# Altium project PCB_pibs_2u_otsd.PrjPcb
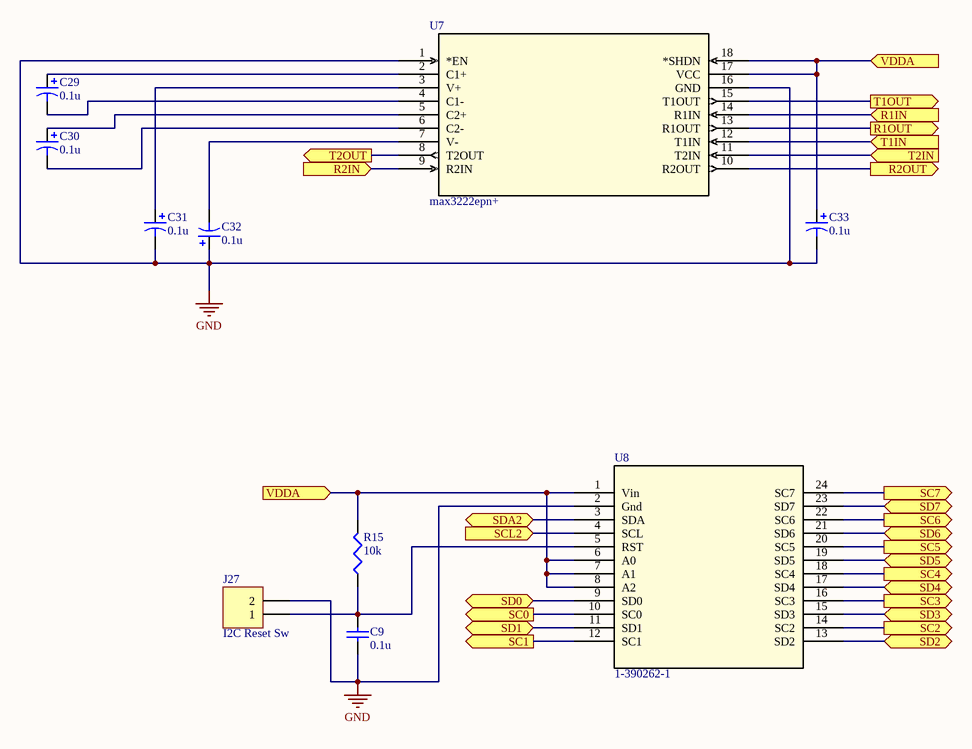
[diagram p0: digital.SchDoc]
12 sheets, 109 parts. Net scope: hierarchical (ports join the sheet entries above them; power ports are global).
Board file: pibs_2u_diff_usb_eth.PcbDoc
Sheets:
  digital.SchDoc
  i2c_diff.SchDoc
  i2c_diff_passive.SchDoc
  i2c_rj45_8_pak.SchDoc
  ftdi_usb.SchDoc
  mcf51jm128vlh.SchDoc
  top_pcb.SchDoc
    um232r = um232r.SchDoc
    ethernet = wiz810smj.SchDoc
    i2c_mux = TCA9548A.SchDoc
    power = power_simp.SchDoc
    headers = headers.SchDoc

## Sheet digital.SchDoc
size A

### Parts
C9  0.1u  [C1206]
C29  0.1u  [C0805]
C30  0.1u  [C0805]
C31  0.1u  [C0805]
C32  0.1u  [C0805]
C33  0.1u  [C0805]
J27  I2C Reset Sw  [HDR1X2]
R15  10k  [J1-0603]
U7  max3222epn+  [21-0043D_18_MXM]
U8  1-390262-1  [1-390262-1_TYC]

### Ports
R1IN (in), R1OUT (out), R2IN (in), R2OUT (out), SC0 (out), SC1 (out), SC2 (out), SC3 (out), SC4 (out), SC5 (out), SC6 (out), SC7 (out), SCL2 (in), SD0 (bidir), SD1 (bidir), SD2 (bidir), SD3 (bidir), SD4 (bidir), SD5 (bidir), SD6 (bidir), SD7 (bidir), SDA2 (bidir), T1IN (in), T1OUT (out), T2IN (in), T2OUT (out), VDDA (in)

### Nets
GND: C9.1 C31.2 C32.1 C33.2 J27.2 U7.1(*EN) U7.16(GND) U8.2(Gnd)
NetC9_2: C9.2 J27.1 R15.1 U8.5(RST)
NetC29_1: C29.1 U7.2(C1+)
NetC29_2: C29.2 U7.4(C1-)
NetC30_1: C30.1 U7.5(C2+)
NetC30_2: C30.2 U7.6(C2-)
NetC31_1: C31.1 U7.3(V+)
NetC32_2: C32.2 U7.7(V-)
NetC33_1: C33.1 R15.2 U7.17(VCC) U7.18(*SHDN) U8.1(Vin) U8.6(A0) U8.7(A1) U8.8(A2) ; port VDDA
NetU7_8: U7.8(T2OUT) ; port T2OUT
NetU7_9: U7.9(R2IN) ; port R2IN
NetU7_10: U7.10(R2OUT) ; port R2OUT
NetU7_11: U7.11(T2IN) ; port T2IN
NetU7_12: U7.12(T1IN) ; port T1IN
NetU7_13: U7.13(R1OUT) ; port R1OUT
NetU7_14: U7.14(R1IN) ; port R1IN
NetU7_15: U7.15(T1OUT) ; port T1OUT
NetU8_3: U8.3(SDA) ; port SDA2
NetU8_4: U8.4(SCL) ; port SCL2
NetU8_9: U8.9(SD0) ; port SD0
NetU8_10: U8.10(SC0) ; port SC0
NetU8_11: U8.11(SD1) ; port SD1
NetU8_12: U8.12(SC1) ; port SC1
NetU8_13: U8.13(SD2) ; port SD2
NetU8_14: U8.14(SC2) ; port SC2
NetU8_15: U8.15(SD3) ; port SD3
NetU8_16: U8.16(SC3) ; port SC3
NetU8_17: U8.17(SD4) ; port SD4
NetU8_18: U8.18(SC4) ; port SC4
NetU8_19: U8.19(SD5) ; port SD5
NetU8_20: U8.20(SC5) ; port SC5
NetU8_21: U8.21(SD6) ; port SD6
NetU8_22: U8.22(SC6) ; port SC6
NetU8_23: U8.23(SD7) ; port SD7
NetU8_24: U8.24(SC7) ; port SC7

### Library data of the parts
C9 = Cap Semi: Capacitor (Semiconductor SIM Model); Value: 100pF; Published: 8-Jun-2000; LatestRevisionDate: 29-May-2009; LatestRevisionNote: IPC-7351 Footprint Added.; PackageReference: C1206; Publisher: Altium Limited; PackageDescription: Chip Capacitor
C29-C33 = Cap Pol3: Polarized Capacitor (Surface Mount); Value: 100pF; Published: 8-Jun-2000; LatestRevisionDate: 29-May-2009; LatestRevisionNote: IPC-7351 Footprint Added.; PackageReference: C0805; Publisher: Altium Limited; PackageDescription: Chip Capacitor
J27 = Header 2: LatestRevisionDate: 17-Jul-2002; LatestRevisionNote: Re-released for DXP Platform.; Publisher: Altium Limited
R15 = Res3: Resistor; Value: 1K; Published: 8-Jun-2000; LatestRevisionDate: 29-May-2009; LatestRevisionNote: IPC-7351 Footprint Added.; PackageReference: J1-0603; Publisher: Altium Limited; PackageDescription: Chip Resistor
U7 = max3222epn+: No Description Available; Mfr_Name: Maxim Integrated Products; Copyright: Copyright (C) 2022 Ultra Librarian. All rights reserved.; Manufacturer_Part_Number: max3222epn+; Digi-Key_Part_Number_1: MAX3222EPN+-ND; RefDes: RefDes; Type: DEV
U8 = 1-390262-1: No Description Available; Mfr_Name: TE Connectivity; Copyright: Copyright (C) 2022 Ultra Librarian. All rights reserved.; Manufacturer_Part_Number: 1-390262-1; RefDes: RefDes; Type: DEV

## Sheet i2c_diff.SchDoc
size A
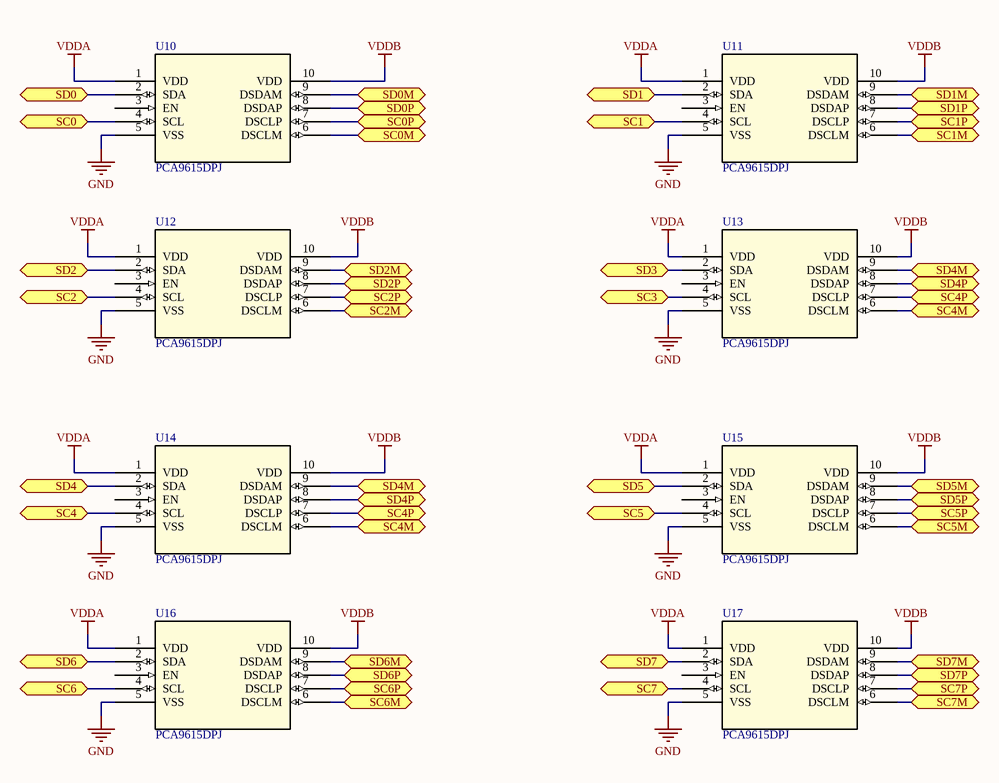
[diagram p1: i2c_diff.SchDoc]

### Parts
(Parts that share a designator on the sheet are numbered #1, #2 ... from top to bottom, then left to right.)
U10  PCA9615DPJ  [TSSOP10_3P1X3P1_NXP]
U11#1  PCA9615DPJ  [TSSOP10_3P1X3P1_NXP]
U12  PCA9615DPJ  [TSSOP10_3P1X3P1_NXP]
U13  PCA9615DPJ  [TSSOP10_3P1X3P1_NXP]
U14  PCA9615DPJ  [TSSOP10_3P1X3P1_NXP]
U15  PCA9615DPJ  [TSSOP10_3P1X3P1_NXP]
U16  PCA9615DPJ  [TSSOP10_3P1X3P1_NXP]
U17  PCA9615DPJ  [TSSOP10_3P1X3P1_NXP]

### Ports
SC0 (bidir), SC0M (bidir), SC0P (bidir), SC1 (bidir), SC1M (bidir), SC1P (bidir), SC2 (bidir), SC2M (bidir), SC2P (bidir), SC3 (bidir), SC4 (bidir), SC4M (bidir), SC4P (bidir), SC5 (bidir), SC5M (bidir), SC5P (bidir), SC6 (bidir), SC6M (bidir), SC6P (bidir), SC7 (bidir), SC7M (bidir), SC7P (bidir), SD0 (bidir), SD0M (bidir), SD0P (bidir), SD1 (bidir), SD1M (bidir), SD1P (bidir), SD2 (bidir), SD2M (bidir), SD2P (bidir), SD3 (bidir), SD4 (bidir), SD4M (bidir), SD4P (bidir), SD5 (bidir), SD5M (bidir), SD5P (bidir), SD6 (bidir), SD6M (bidir), SD6P (bidir), SD7 (bidir), SD7M (bidir), SD7P (bidir)

### Nets
GND: U10.5(VSS) U11#1.5(VSS) U12.5(VSS) U13.5(VSS) U14.5(VSS) U15.5(VSS) U16.5(VSS) U17.5(VSS)
VDDA: U10.1(VDD) U11#1.1(VDD) U12.1(VDD) U13.1(VDD) U14.1(VDD) U15.1(VDD) U16.1(VDD) U17.1(VDD)
VDDB: U10.10(VDD) U11#1.10(VDD) U12.10(VDD) U13.10(VDD) U14.10(VDD) U15.10(VDD) U16.10(VDD) U17.10(VDD)
NetU10_2: U10.2(SDA) ; port SD0
NetU10_4: U10.4(SCL) ; port SC0
NetU10_6: U10.6(DSCLM) ; port SC0M
NetU10_7: U10.7(DSCLP) ; port SC0P
NetU10_8: U10.8(DSDAP) ; port SD0P
NetU10_9: U10.9(DSDAM) ; port SD0M
NetU11#1_2: U11#1.2(SDA) ; port SD1
NetU11#1_4: U11#1.4(SCL) ; port SC1
NetU11#1_6: U11#1.6(DSCLM) ; port SC1M
NetU11#1_7: U11#1.7(DSCLP) ; port SC1P
NetU11#1_8: U11#1.8(DSDAP) ; port SD1P
NetU11#1_9: U11#1.9(DSDAM) ; port SD1M
NetU12_2: U12.2(SDA) ; port SD2
NetU12_4: U12.4(SCL) ; port SC2
NetU12_6: U12.6(DSCLM) ; port SC2M
NetU12_7: U12.7(DSCLP) ; port SC2P
NetU12_8: U12.8(DSDAP) ; port SD2P
NetU12_9: U12.9(DSDAM) ; port SD2M
NetU13_2: U13.2(SDA) ; port SD3
NetU13_4: U13.4(SCL) ; port SC3
NetU13_6: U13.6(DSCLM) U14.6(DSCLM) ; port SC4M
NetU13_7: U13.7(DSCLP) U14.7(DSCLP) ; port SC4P
NetU13_8: U13.8(DSDAP) U14.8(DSDAP) ; port SD4P
NetU13_9: U13.9(DSDAM) U14.9(DSDAM) ; port SD4M
NetU14_2: U14.2(SDA) ; port SD4
NetU14_4: U14.4(SCL) ; port SC4
NetU15_2: U15.2(SDA) ; port SD5
NetU15_4: U15.4(SCL) ; port SC5
NetU15_6: U15.6(DSCLM) ; port SC5M
NetU15_7: U15.7(DSCLP) ; port SC5P
NetU15_8: U15.8(DSDAP) ; port SD5P
NetU15_9: U15.9(DSDAM) ; port SD5M
NetU16_2: U16.2(SDA) ; port SD6
NetU16_4: U16.4(SCL) ; port SC6
NetU16_6: U16.6(DSCLM) ; port SC6M
NetU16_7: U16.7(DSCLP) ; port SC6P
NetU16_8: U16.8(DSDAP) ; port SD6P
NetU16_9: U16.9(DSDAM) ; port SD6M
NetU17_2: U17.2(SDA) ; port SD7
NetU17_4: U17.4(SCL) ; port SC7
NetU17_6: U17.6(DSCLM) ; port SC7M
NetU17_7: U17.7(DSCLP) ; port SC7P
NetU17_8: U17.8(DSDAP) ; port SD7P
NetU17_9: U17.9(DSDAM) ; port SD7M

Not connected (* = marked no-connect by the designer): U10 3(EN); U11#1 3(EN); U12 3(EN); U13 3(EN); U14 3(EN); U15 3(EN); U16 3(EN); U17 3(EN)

### Library data of the parts
U10 U11#1 U12-U17 = PCA9615DPJ: No Description Available; Mfr_Name: NXP; Copyright: Copyright (C) 2022 Ultra Librarian. All rights reserved.; Manufacturer_Part_Number: PCA9615DPJ; RefDes: RefDes; Type: DEV

## Sheet i2c_diff_passive.SchDoc
size A
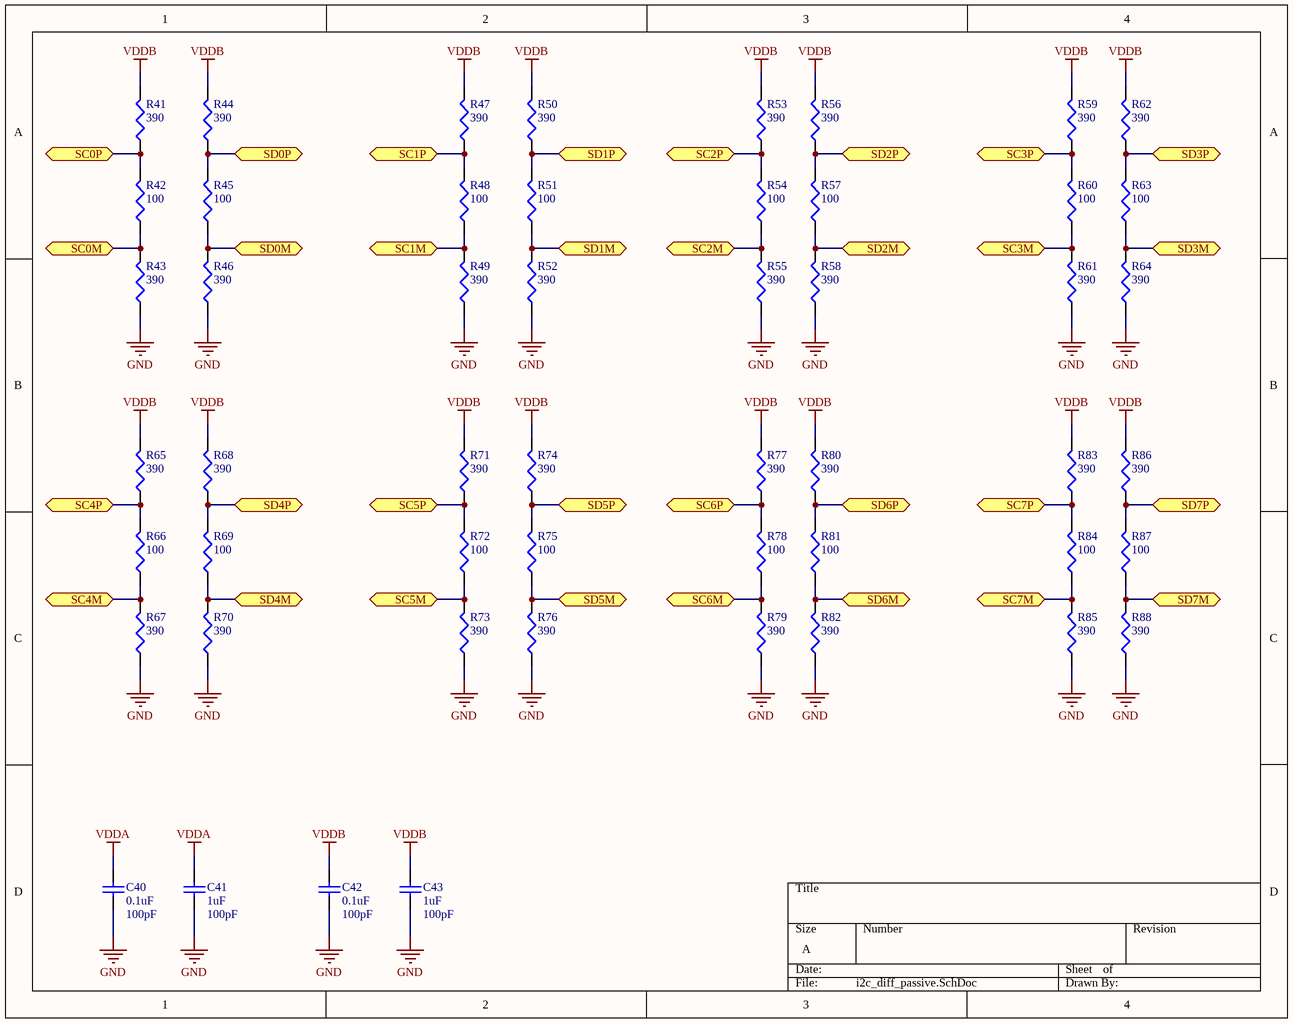
[diagram p2: i2c_diff_passive.SchDoc]

### Parts
C40  0.1uF  value 100pF  [C1206]
C41  1uF  value 100pF  [C1206]
C42  0.1uF  value 100pF  [C1206]
C43  1uF  value 100pF  [C1206]
R41  390  [J1-0603]
R42  100  [J1-0603]
R43  390  [J1-0603]
R44  390  [J1-0603]
R45  100  [J1-0603]
R46  390  [J1-0603]
R47  390  [J1-0603]
R48  100  [J1-0603]
R49  390  [J1-0603]
R50  390  [J1-0603]
R51  100  [J1-0603]
R52  390  [J1-0603]
R53  390  [J1-0603]
R54  100  [J1-0603]
R55  390  [J1-0603]
R56  390  [J1-0603]
R57  100  [J1-0603]
R58  390  [J1-0603]
R59  390  [J1-0603]
R60  100  [J1-0603]
R61  390  [J1-0603]
R62  390  [J1-0603]
R63  100  [J1-0603]
R64  390  [J1-0603]
R65  390  [J1-0603]
R66  100  [J1-0603]
R67  390  [J1-0603]
R68  390  [J1-0603]
R69  100  [J1-0603]
R70  390  [J1-0603]
R71  390  [J1-0603]
R72  100  [J1-0603]
R73  390  [J1-0603]
R74  390  [J1-0603]
R75  100  [J1-0603]
R76  390  [J1-0603]
R77  390  [J1-0603]
R78  100  [J1-0603]
R79  390  [J1-0603]
R80  390  [J1-0603]
R81  100  [J1-0603]
R82  390  [J1-0603]
R83  390  [J1-0603]
R84  100  [J1-0603]
R85  390  [J1-0603]
R86  390  [J1-0603]
R87  100  [J1-0603]
R88  390  [J1-0603]

### Ports
SC0M (bidir), SC0P (bidir), SC1M (bidir), SC1P (bidir), SC2M (bidir), SC2P (bidir), SC3M (bidir), SC3P (bidir), SC4M (bidir), SC4P (bidir), SC5M (bidir), SC5P (bidir), SC6M (bidir), SC6P (bidir), SC7M (bidir), SC7P (bidir), SD0M (bidir), SD0P (bidir), SD1M (bidir), SD1P (bidir), SD2M (bidir), SD2P (bidir), SD3M (bidir), SD3P (bidir), SD4M (bidir), SD4P (bidir), SD5M (bidir), SD5P (bidir), SD6M (bidir), SD6P (bidir), SD7M (bidir), SD7P (bidir)

### Nets
GND: C40.1 C41.1 C42.1 C43.1 R43.1 R46.1 R49.1 R52.1 R55.1 R58.1 R61.1 R64.1 R67.1 R70.1 R73.1 R76.1 R79.1 R82.1 R85.1 R88.1
VDDA: C40.2 C41.2
VDDB: C42.2 C43.2 R41.2 R44.2 R47.2 R50.2 R53.2 R56.2 R59.2 R62.2 R65.2 R68.2 R71.2 R74.2 R77.2 R80.2 R83.2 R86.2
NetR41_1: R41.1 R42.2 ; port SC0P
NetR42_1: R42.1 R43.2 ; port SC0M
NetR44_1: R44.1 R45.2 ; port SD0P
NetR45_1: R45.1 R46.2 ; port SD0M
NetR47_1: R47.1 R48.2 ; port SC1P
NetR48_1: R48.1 R49.2 ; port SC1M
NetR50_1: R50.1 R51.2 ; port SD1P
NetR51_1: R51.1 R52.2 ; port SD1M
NetR53_1: R53.1 R54.2 ; port SC2P
NetR54_1: R54.1 R55.2 ; port SC2M
NetR56_1: R56.1 R57.2 ; port SD2P
NetR57_1: R57.1 R58.2 ; port SD2M
NetR59_1: R59.1 R60.2 ; port SC3P
NetR60_1: R60.1 R61.2 ; port SC3M
NetR62_1: R62.1 R63.2 ; port SD3P
NetR63_1: R63.1 R64.2 ; port SD3M
NetR65_1: R65.1 R66.2 ; port SC4P
NetR66_1: R66.1 R67.2 ; port SC4M
NetR68_1: R68.1 R69.2 ; port SD4P
NetR69_1: R69.1 R70.2 ; port SD4M
NetR71_1: R71.1 R72.2 ; port SC5P
NetR72_1: R72.1 R73.2 ; port SC5M
NetR74_1: R74.1 R75.2 ; port SD5P
NetR75_1: R75.1 R76.2 ; port SD5M
NetR77_1: R77.1 R78.2 ; port SC6P
NetR78_1: R78.1 R79.2 ; port SC6M
NetR80_1: R80.1 R81.2 ; port SD6P
NetR81_1: R81.1 R82.2 ; port SD6M
NetR83_1: R83.1 R84.2 ; port SC7P
NetR84_1: R84.1 R85.2 ; port SC7M
NetR86_1: R86.1 R87.2 ; port SD7P
NetR87_1: R87.1 R88.2 ; port SD7M

### Library data of the parts
C40-C43 = Cap Semi: Capacitor (Semiconductor SIM Model); Published: 8-Jun-2000; LatestRevisionDate: 29-May-2009; LatestRevisionNote: IPC-7351 Footprint Added.; PackageReference: C1206; Publisher: Altium Limited; PackageDescription: Chip Capacitor
R41-R88 = Res3: Resistor; Value: 1K; Published: 8-Jun-2000; LatestRevisionDate: 29-May-2009; LatestRevisionNote: IPC-7351 Footprint Added.; PackageReference: J1-0603; Publisher: Altium Limited; PackageDescription: Chip Resistor

## Sheet i2c_rj45_8_pak.SchDoc
size A; SheetNumber: 9; SheetTotal: 9; PageSetup: Record=PageOptions|CenterHorizontal=True|CenterVertical=True|PrintScale=1.05|XCorrection=1.00|YCorrection=1.00|PrintKind=0|BorderSize=5000000|LeftOffset=0|BottomOffset=0|Orientation=2|PaperLength=1000|PaperWidth=1000|Scale=100|PaperSource=7|PrintQuality=-3|MediaType=1|DitherType=10|PrintScaleMode=1|PaperKind=Letter 8.5"x11" 22x28cm|PaperIndex=1

## Sheet ftdi_usb.SchDoc: PIBS
size A; Date: 8/17/22; CheckedBy: VDT; Author: VDT; CompanyName: PolySoftique; DrawnBy: VDT; Engineer: VDT; Revision: A; SheetNumber: 4; SheetTotal: 9; CurrentDate: 8/17/22; ProjectName: Pibs_Eth

## Sheet mcf51jm128vlh.SchDoc
size B
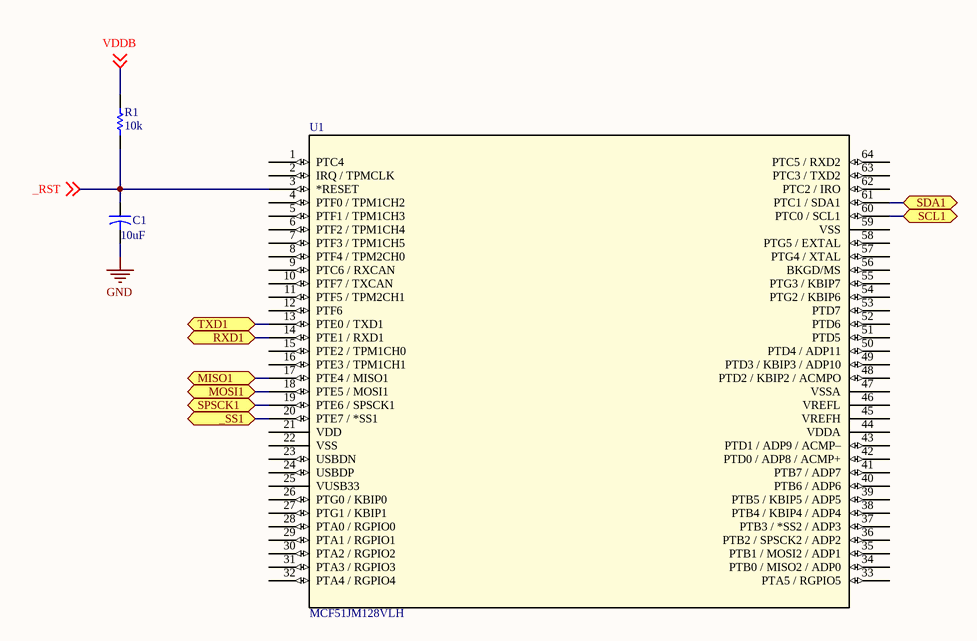
[diagram p3: mcf51jm128vlh.SchDoc]

### Parts
C1  value 10uF  [CAPR5-4X5]  (hidden comment: Cap2)
R1  value 10k  [AXIAL-0.3]  (hidden comment: Res1)
U1  MCF51JM128VLH  [QFP64_FRE]

### Ports
_SS1, MISO1, MOSI1, RXD1, SCL1, SDA1, SPSCK1, TXD1

### Nets
GND: C1.2
_RST: C1.1 R1.1 U1.3(*RESET) ; off-sheet _RST
VDDB: R1.2 ; off-sheet VDDB
NetU1_13: U1.13(PTE0_/_TXD1) ; port TXD1
NetU1_14: U1.14(PTE1_/_RXD1) ; port RXD1
NetU1_17: U1.17(PTE4_/_MISO1) ; port MISO1
NetU1_18: U1.18(PTE5_/_MOSI1) ; port MOSI1
NetU1_19: U1.19(PTE6_/_SPSCK1) ; port SPSCK1
NetU1_20: U1.20(PTE7_/_*SS1) ; port _SS1
NetU1_60: U1.60(PTC0_/_SCL1) ; port SCL1
NetU1_61: U1.61(PTC1_/_SDA1) ; port SDA1

Not connected (* = marked no-connect by the designer): U1 1(PTC4) 2(IRQ_/_TPMCLK) 4(PTF0_/_TPM1CH2) 5(PTF1_/_TPM1CH3) 6(PTF2_/_TPM1CH4) 7(PTF3_/_TPM1CH5) 8(PTF4_/_TPM2CH0) 9(PTC6_/_RXCAN) 10(PTF7_/_TXCAN) 11(PTF5_/_TPM2CH1) 12(PTF6) 15(PTE2_/_TPM1CH0) 16(PTE3_/_TPM1CH1) 21(VDD) 22(VSS) 23(USBDN) 24(USBDP) 25(VUSB33) 26(PTG0_/_KBIP0) 27(PTG1_/_KBIP1) 28(PTA0_/_RGPIO0) 29(PTA1_/_RGPIO1) 30(PTA2_/_RGPIO2) 31(PTA3_/_RGPIO3) 32(PTA4_/_RGPIO4) 33(PTA5_/_RGPIO5) 34(PTB0_/_MISO2_/_ADP0) 35(PTB1_/_MOSI2_/_ADP1) 36(PTB2_/_SPSCK2_/_ADP2) 37(PTB3_/_*SS2_/_ADP3) 38(PTB4_/_KBIP4_/_ADP4) 39(PTB5_/_KBIP5_/_ADP5) 40(PTB6_/_ADP6) 41(PTB7_/_ADP7) 42(PTD0_/_ADP8_/_ACMP+) 43(PTD1_/_ADP9_/_ACMP–) 44(VDDA) 45(VREFH) 46(VREFL) 47(VSSA) 48(PTD2_/_KBIP2_/_ACMPO) 49(PTD3_/_KBIP3_/_ADP10) 50(PTD4_/_ADP11) 51(PTD5) 52(PTD6) 53(PTD7) 54(PTG2_/_KBIP6) 55(PTG3_/_KBIP7) 56(BKGD/MS) 57(PTG4_/_XTAL) 58(PTG5_/_EXTAL) 59(VSS) 62(PTC2_/_IRO) 63(PTC3_/_TXD2) 64(PTC5_/_RXD2)

### Library data of the parts
C1 = Cap2: Capacitor; Published: 23-Sep-2002; PackageReference: CAPR5-4X5; Publisher: Altium Limited; PackageDescription: Capacitor; 2 Leads
R1 = Res1: Resistor; Published: 8-Jun-2000; LatestRevisionDate: 17-Jul-2002; LatestRevisionNote: Re-released for DXP Platform.; PackageReference: AXIAL-0.3; Publisher: Altium Limited; PackageDescription: Axial Device, Thru-Hole; 2 Leads; 0.3 in Pin Spacing
U1 = MCF51JM128VLH: No Description Available; Mfr_Name: NXP / Freescale; RefDes: RefDes; Type: Type

## Sheet top_pcb.SchDoc
size B
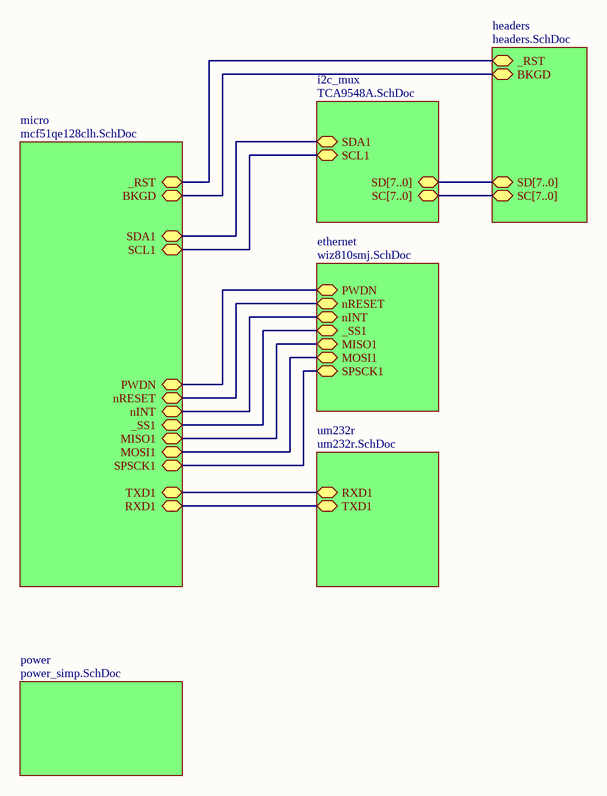
[diagram p4: top_pcb.SchDoc]

### Sub-sheets
ethernet = wiz810smj.SchDoc: _SS1, MISO1, MOSI1, SPSCK1, nINT, nRESET, PWDN
headers = headers.SchDoc: SD[7..0], SC[7..0], _RST, BKGD
i2c_mux = TCA9548A.SchDoc: SDA1, SCL1, SC[7..0], SD[7..0]
micro = mcf51qe128clh.SchDoc (file not in this document): SDA1, SCL1, _SS1, MISO1, MOSI1, SPSCK1, TXD1, RXD1, BKGD, _RST, PWDN, nRESET, nINT
power = power_simp.SchDoc: no entries
um232r = um232r.SchDoc: TXD1, RXD1

### Nets
NetU2_3: sheet micro/SDA1, sheet i2c_mux/SDA1
NetU2_4: sheet micro/SCL1, sheet i2c_mux/SCL1
NetU3_1: sheet micro/TXD1, sheet um232r/RXD1
NetU3_5: sheet micro/RXD1, sheet um232r/TXD1
(unnamed): sheet micro/_SS1, sheet ethernet/_SS1
(unnamed): sheet micro/MISO1, sheet ethernet/MISO1
(unnamed): sheet micro/MOSI1, sheet ethernet/MOSI1
(unnamed): sheet micro/SPSCK1, sheet ethernet/SPSCK1
(unnamed): sheet micro/BKGD, sheet headers/BKGD
(unnamed): sheet micro/_RST, sheet headers/_RST
(unnamed): sheet micro/PWDN, sheet ethernet/PWDN
(unnamed): sheet micro/nRESET, sheet ethernet/nRESET
(unnamed): sheet micro/nINT, sheet ethernet/nINT

### Buses and harness runs
bus sheet headers/SC[7..0] = sheet i2c_mux/SC[7..0]
bus sheet headers/SD[7..0] = sheet i2c_mux/SD[7..0]

## Sheet um232r.SchDoc
size A
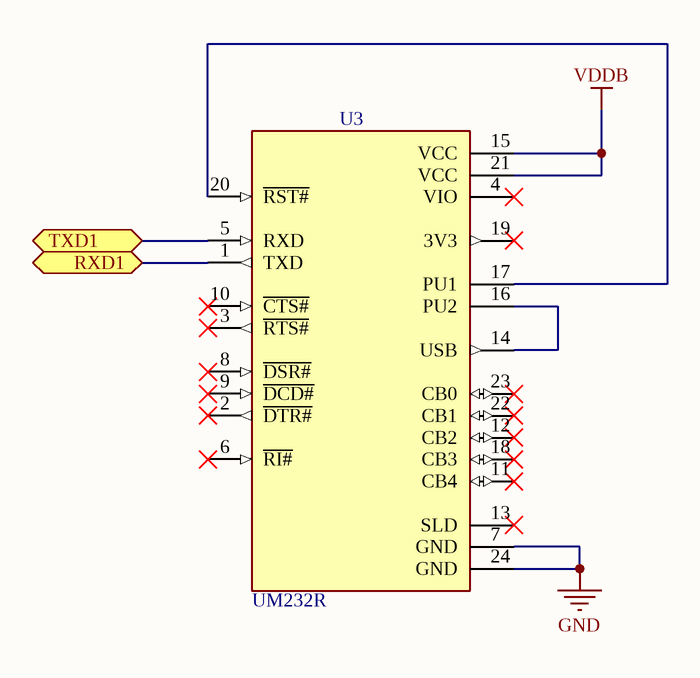
[diagram p5: um232r.SchDoc]

### Parts
U3  UM232R  [MODULE_UM232R]

### Ports
RXD1, TXD1

### Nets
GND: U3.7(GND) U3.24(GND)
VDDB: U3.15(VCC) U3.21(VCC)
NetU3_1: U3.1(TXD) ; port RXD1
NetU3_5: U3.5(RXD) ; port TXD1
NetU3_14: U3.14(USB) U3.16(PU2)
NetU3_17: U3.17(PU1) U3.20(~{RST#})

Not connected (* = marked no-connect by the designer): U3 2(~{DTR#})* 3(~{RTS#})* 4(VIO)* 6(~{RI#})* 8(~{DSR#})* 9(~{DCD#})* 10(~{CTS#})* 11(CB4)* 12(CB2)* 13(SLD)* 18(CB3)* 19(3V3)* 22(CB1)* 23(CB0)*

### Library data of the parts
U3 = UM232R: FT232R USB 2.0 to UART (RS232) Bridge Interface Evaluation Board; MF: FTDI,; Package: DIP-24 FTDI; MP: UM232R; Price: None; Availability: Unavailable; Value: *; SnapEDA_Link: https://www.snapeda.com/parts/UM232R/FTDI,%20Future%20Technology%20Devices%20International%20Ltd/view-part/424493/?ref=snap; BuyPart: https://www.snapeda.com/parts/UM232R/FTDI,%20Future%20Technology%20Devices%20International%20Ltd/view-part/424493/?ref=eda

## Sheet wiz810smj.SchDoc
size A
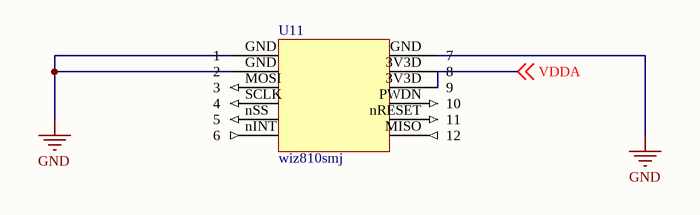
[diagram p6: wiz810smj.SchDoc]

### Parts
(Parts that share a designator on the sheet are numbered #1, #2 ... from top to bottom, then left to right.)
U11#2  wiz810smj

### Nets

Not connected (* = marked no-connect by the designer): U11#2 3V3D(9) GND(1) MISO(12) MOSI(3) nINT(6) nRESET(11) nSS(5) PWDN(10) SCLK(4)

## Sheet TCA9548A.SchDoc
size A
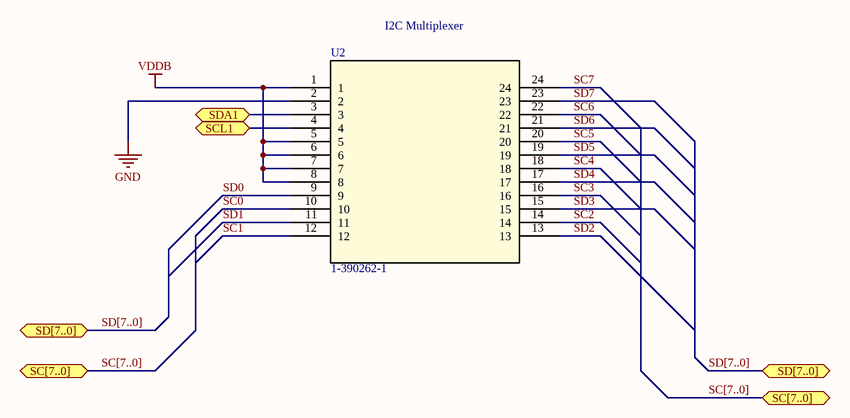
[diagram p7: TCA9548A.SchDoc]

### Parts
U2  1-390262-1  [1-390262-1_TYC]

### Ports
SC[7..0], SCL1, SD[7..0], SDA1

### Nets
GND: U2.2
VDDB: U2.1 U2.5 U2.6 U2.7 U2.8
SC0: U2.10
SC1: U2.12
SC2: U2.14
SC3: U2.16
SC4: U2.18
SC5: U2.20
SC6: U2.22
SC7: U2.24
SD0: U2.9
SD1: U2.11
SD2: U2.13
SD3: U2.15
SD4: U2.17
SD5: U2.19
SD6: U2.21
SD7: U2.23
NetU2_3: U2.3 ; port SDA1
NetU2_4: U2.4 ; port SCL1

### Buses and harness runs
bus SC[7..0] = port SC[7..0]
bus SD[7..0] = port SD[7..0]

### Notes on the sheet
- I2C Multiplexer

### Library data of the parts
U2 = 1-390262-1: as U8 on sheet digital; Copyright: Copyright (C) 2022 Ultra Librarian. All rights reserved.; Manufacturer_Part_Number: 1-390262-1; RefDes: RefDes; Type: DEV

## Sheet power_simp.SchDoc
size A; SheetNumber: 3; SheetTotal: 9; PageSetup: Record=PageOptions|CenterHorizontal=True|CenterVertical=True|PrintScale=1.05|XCorrection=1.00|YCorrection=1.00|PrintKind=0|BorderSize=5000000|LeftOffset=0|BottomOffset=0|Orientation=2|PaperLength=1000|PaperWidth=1000|Scale=100|PaperSource=276|PrintQuality=-3|MediaType=1|DitherType=10|PrintScaleMode=1|PaperKind=Letter 8.5"x11" 22x28cm|PaperIndex=1
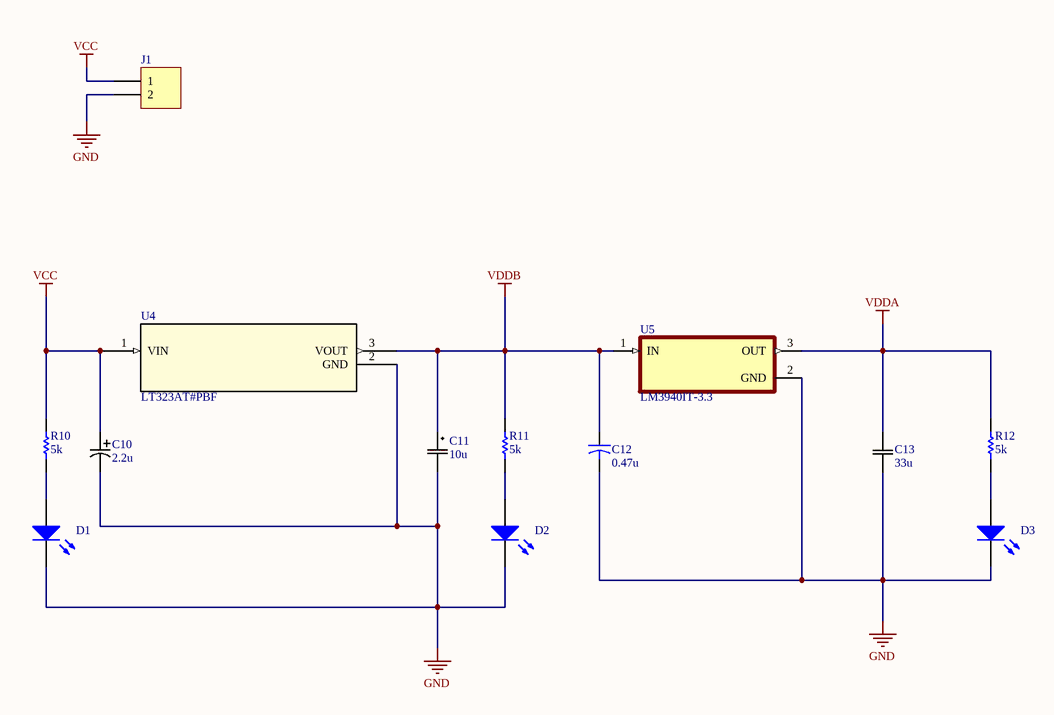
[diagram p8: power_simp.SchDoc]

### Parts
C10  2.2u  [PCAP_3x5-THRU-ELECT_NCA]
C11  10u  [CAP_UHC_4X7_NCH]
C12  value 0.47u  [CAPR5-4X5]  (hidden comment: Cap2)
C13  33u  [CAP_FG16X5R1E336MRT06_TDK]
D1  LED1  [LED-1]  (value not drawn)
D2  LED1  [LED-1]  (value not drawn)
D3  LED1  [LED-1]  (value not drawn)
J1  Header 2  [HDR1X2]  (value not drawn)
R10  value 5k  [AXIAL-0.3]  (hidden comment: Res1)
R11  value 5k  [AXIAL-0.3]  (hidden comment: Res1)
R12  value 5k  [AXIAL-0.3]  (hidden comment: Res1)
U4  LT323AT#PBF  [TO-220-AB]
U5  LM3940IT-3.3  [TO254P1054X470X1955-3]

### Nets
GND: C10.2 C11.2 C12.2 C13.1 D1.2(K) D2.2(K) D3.2(K) J1.2 U4.2(GND) U5.2(GND)
VCC: C10.1 J1.1 R10.2 U4.1(VIN)
VDDA: C13.2 R12.2 U5.3(OUT)
VDDB: C11.1 C12.1 R11.2 U4.3(VOUT) U5.1(IN)
NetD1_1: D1.1(A) R10.1
NetD2_1: D2.1(A) R11.1
NetD3_1: D3.1(A) R12.1

### Library data of the parts
C10 = UMA1V2R2MCD2: No Description Available; Mfr_Name: Nichicon
C11 = USR1E100MDD1TE: No Description Available; Mfr_Name: Nichicon
C12 = Cap2: Capacitor; Published: 23-Sep-2002; PackageReference: CAPR5-4X5; Publisher: Altium Limited; PackageDescription: Capacitor; 2 Leads
C13 = FG16X5R1E336MRT06: No Description Available; Mfr_Name: TDK
D1-D3 = LED1: Typical RED GaAs LED; Published: 8-Jun-2000; LatestRevisionDate: 08-Jul-2005; LatestRevisionNote: Mech Layer 1 removed.; PackageReference: LED-1; Publisher: Altium Limited; PackageDescription: LED; 2 Leads
J1 = Header 2: Header, 2-Pin; LatestRevisionDate: 17-Jul-2002; LatestRevisionNote: Re-released for DXP Platform.; Publisher: Altium Limited
R10-R12 = Res1: Resistor; Published: 8-Jun-2000; LatestRevisionDate: 17-Jul-2002; LatestRevisionNote: Re-released for DXP Platform.; PackageReference: AXIAL-0.3; Publisher: Altium Limited; PackageDescription: Axial Device, Thru-Hole; 2 Leads; 0.3 in Pin Spacing
U4 = LT323AT#PBF: No Description Available; Mfr_Name: Analog Devices / Linear Technology; Copyright: Copyright (C) 2022 Ultra Librarian. All rights reserved.; Manufacturer_Part_Number: LT323AT#PBF; Digi-Key_Part_Number_1: LT323AT#PBF-ND; RefDes: RefDes; Type: DEV
U5 = LM3940IT-3.3: 1-A, low-dropout voltage regulator for 5-V to 3.3-V conversion 3-TO-220 -40 to 125; MF: Texas Instruments; SnapEDA_Link: https://www.snapeda.com/parts/LM3940IT-3.3/Texas%20Instruments/view-part/50717/?ref=snap; Availability: Warning; Price: None; MP: LM3940IT-3.3; Check_prices: https://www.snapeda.com/parts/LM3940IT-3.3/Texas%20Instruments/view-part/50717/?ref=eda; Purchase-URL: https://pricing.snapeda.com/search/part/LM3940IT-3.3/?ref=eda; Package: TO-220-3 Texas Instruments; Value: *

## Sheet headers.SchDoc: Headers
size A
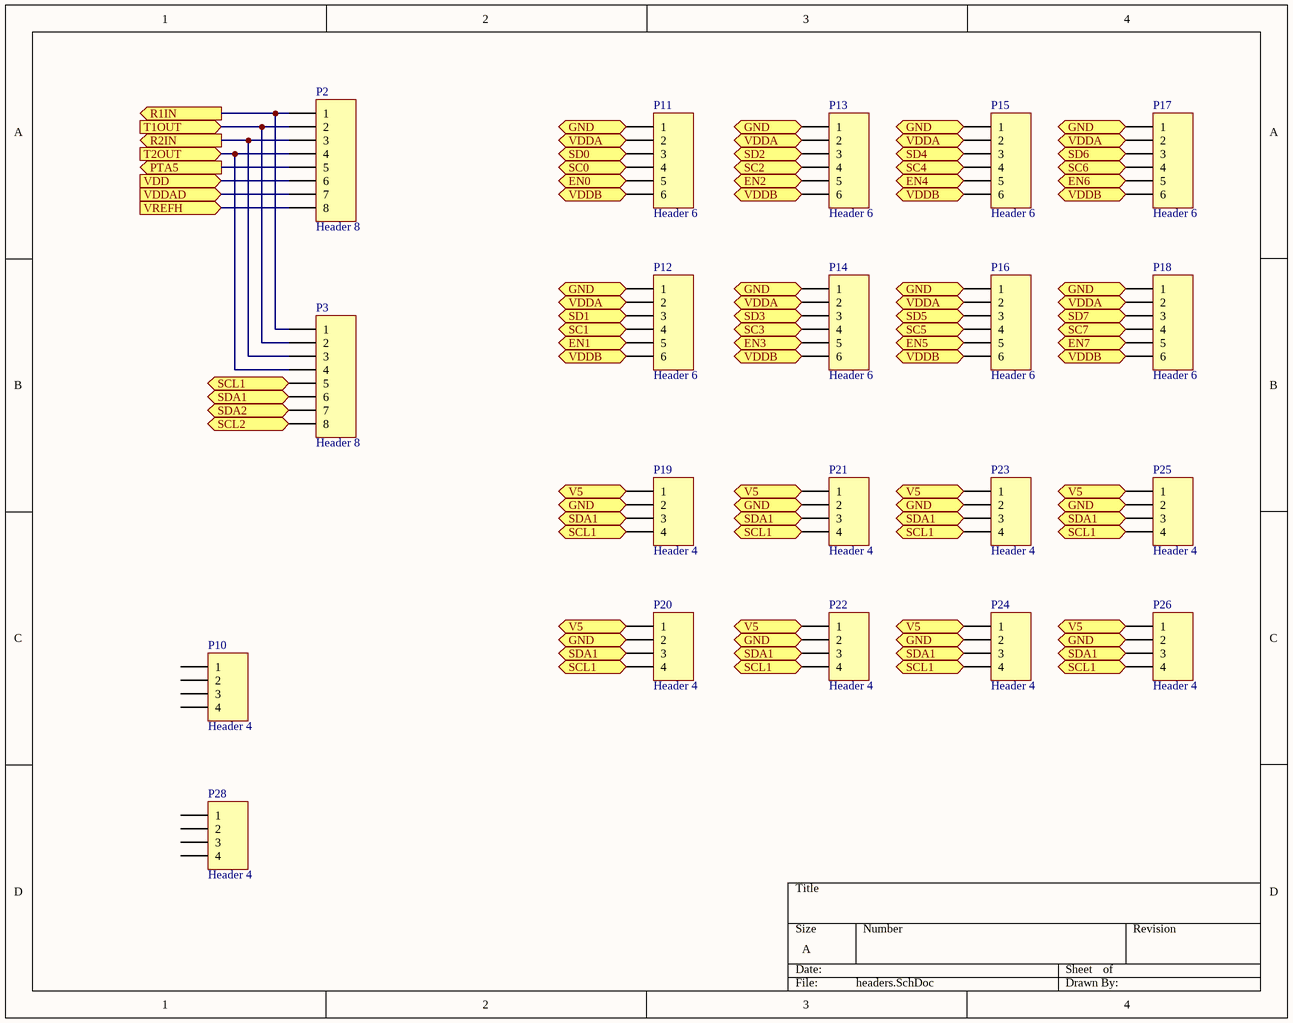
[diagram p9: headers.SchDoc]

### Parts
P2  Header 8  [HDR1X8]
P3  Header 8  [HDR1X8]
P10  Header 4  [HDR1X4]
P11  Header 6  [HDR1X6]
P12  Header 6  [HDR1X6]
P13  Header 6  [HDR1X6]
P14  Header 6  [HDR1X6]
P15  Header 6  [HDR1X6]
P16  Header 6  [HDR1X6]
P17  Header 6  [HDR1X6]
P18  Header 6  [HDR1X6]
P19  Header 4  [HDR1X4]
P20  Header 4  [HDR1X4]
P21  Header 4  [HDR1X4]
P22  Header 4  [HDR1X4]
P23  Header 4  [HDR1X4]
P24  Header 4  [HDR1X4]
P25  Header 4  [HDR1X4]
P26  Header 4  [HDR1X4]
P28  Header 4  [HDR1X4]

### Ports
EN0 (out), EN1 (out), EN2 (out), EN3 (out), EN4 (out), EN5 (out), EN6 (out), EN7 (out), GND (in), GND (out), PTA5 (out), R1IN (out), R2IN (out), SC0 (bidir), SC1 (bidir), SC2 (bidir), SC3 (bidir), SC4 (bidir), SC5 (bidir), SC6 (bidir), SC7 (bidir), SCL1 (in), SCL2 (in), SD0 (bidir), SD1 (bidir), SD2 (bidir), SD3 (bidir), SD4 (bidir), SD5 (bidir), SD6 (bidir), SD7 (bidir), SDA1 (in), SDA2 (in), T1OUT (in), T2OUT (in), V5 (in), VDD (in), VDDA (out), VDDAD (in), VDDB (out), VREFH (in)

### Nets
NetP2_1: P2.1 P3.1 ; port R1IN
NetP2_2: P2.2 P3.2 ; port T1OUT
NetP2_3: P2.3 P3.3 ; port R2IN
NetP2_4: P2.4 P3.4 ; port T2OUT
NetP2_5: P2.5 ; port PTA5
NetP2_6: P2.6 ; port VDD
NetP2_7: P2.7 ; port VDDAD
NetP2_8: P2.8 ; port VREFH
NetP3_5: P3.5 P19.4 P20.4 P21.4 P22.4 P23.4 P24.4 P25.4 P26.4 ; port SCL1
NetP3_6: P3.6 P19.3 P20.3 P21.3 P22.3 P23.3 P24.3 P25.3 P26.3 ; port SDA1
NetP3_7: P3.7 ; port SDA2
NetP3_8: P3.8 ; port SCL2
NetP11_1: P11.1 P12.1 P13.1 P14.1 P15.1 P16.1 P17.1 P18.1 P19.2 P20.2 P21.2 P22.2 P23.2 P24.2 P25.2 P26.2 ; port GND
NetP11_2: P11.2 P12.2 P13.2 P14.2 P15.2 P16.2 P17.2 P18.2 ; port VDDA
NetP11_3: P11.3 ; port SD0
NetP11_4: P11.4 ; port SC0
NetP11_5: P11.5 ; port EN0
NetP11_6: P11.6 P12.6 P13.6 P14.6 P15.6 P16.6 P17.6 P18.6 ; port VDDB
NetP12_3: P12.3 ; port SD1
NetP12_4: P12.4 ; port SC1
NetP12_5: P12.5 ; port EN1
NetP13_3: P13.3 ; port SD2
NetP13_4: P13.4 ; port SC2
NetP13_5: P13.5 ; port EN2
NetP14_3: P14.3 ; port SD3
NetP14_4: P14.4 ; port SC3
NetP14_5: P14.5 ; port EN3
NetP15_3: P15.3 ; port SD4
NetP15_4: P15.4 ; port SC4
NetP15_5: P15.5 ; port EN4
NetP16_3: P16.3 ; port SD5
NetP16_4: P16.4 ; port SC5
NetP16_5: P16.5 ; port EN5
NetP17_3: P17.3 ; port SD6
NetP17_4: P17.4 ; port SC6
NetP17_5: P17.5 ; port EN6
NetP18_3: P18.3 ; port SD7
NetP18_4: P18.4 ; port SC7
NetP18_5: P18.5 ; port EN7
NetP19_1: P19.1 P20.1 P21.1 P22.1 P23.1 P24.1 P25.1 P26.1 ; port V5

Not connected (* = marked no-connect by the designer): P10 1 2 3 4; P28 1 2 3 4

### Library data of the parts
P2 P3 = Header 8: Header, 8-Pin; LatestRevisionDate: 17-Jul-2002; LatestRevisionNote: Re-released for DXP Platform.; Publisher: Altium Limited
P10 P19-P26 P28 = Header 4: Header, 4-Pin; LatestRevisionDate: 17-Jul-2002; LatestRevisionNote: Re-released for DXP Platform.; Publisher: Altium Limited
P11-P18 = Header 6: Header, 6-Pin; LatestRevisionDate: 17-Jul-2002; LatestRevisionNote: Re-released for DXP Platform.; Publisher: Altium Limited

## Nets that join several sheets
GND: digital (8 pins), i2c_diff (8 pins), i2c_diff_passive (20 pins), mcf51jm128vlh (C1.2), um232r (U3.7 U3.24), TCA9548A (U2.2), power_simp (10 pins)
VDDA: i2c_diff (8 pins), i2c_diff_passive (C40.2 C41.2), power_simp (C13.2 R12.2 U5.3)
VDDB: i2c_diff (8 pins), i2c_diff_passive (18 pins), um232r (U3.15 U3.21), TCA9548A (5 pins), power_simp (5 pins)